# Altium schematic sheet DRV8302.SchDoc
size 431 x 279 mm; SheetNumber: 4; SheetTotal: 6
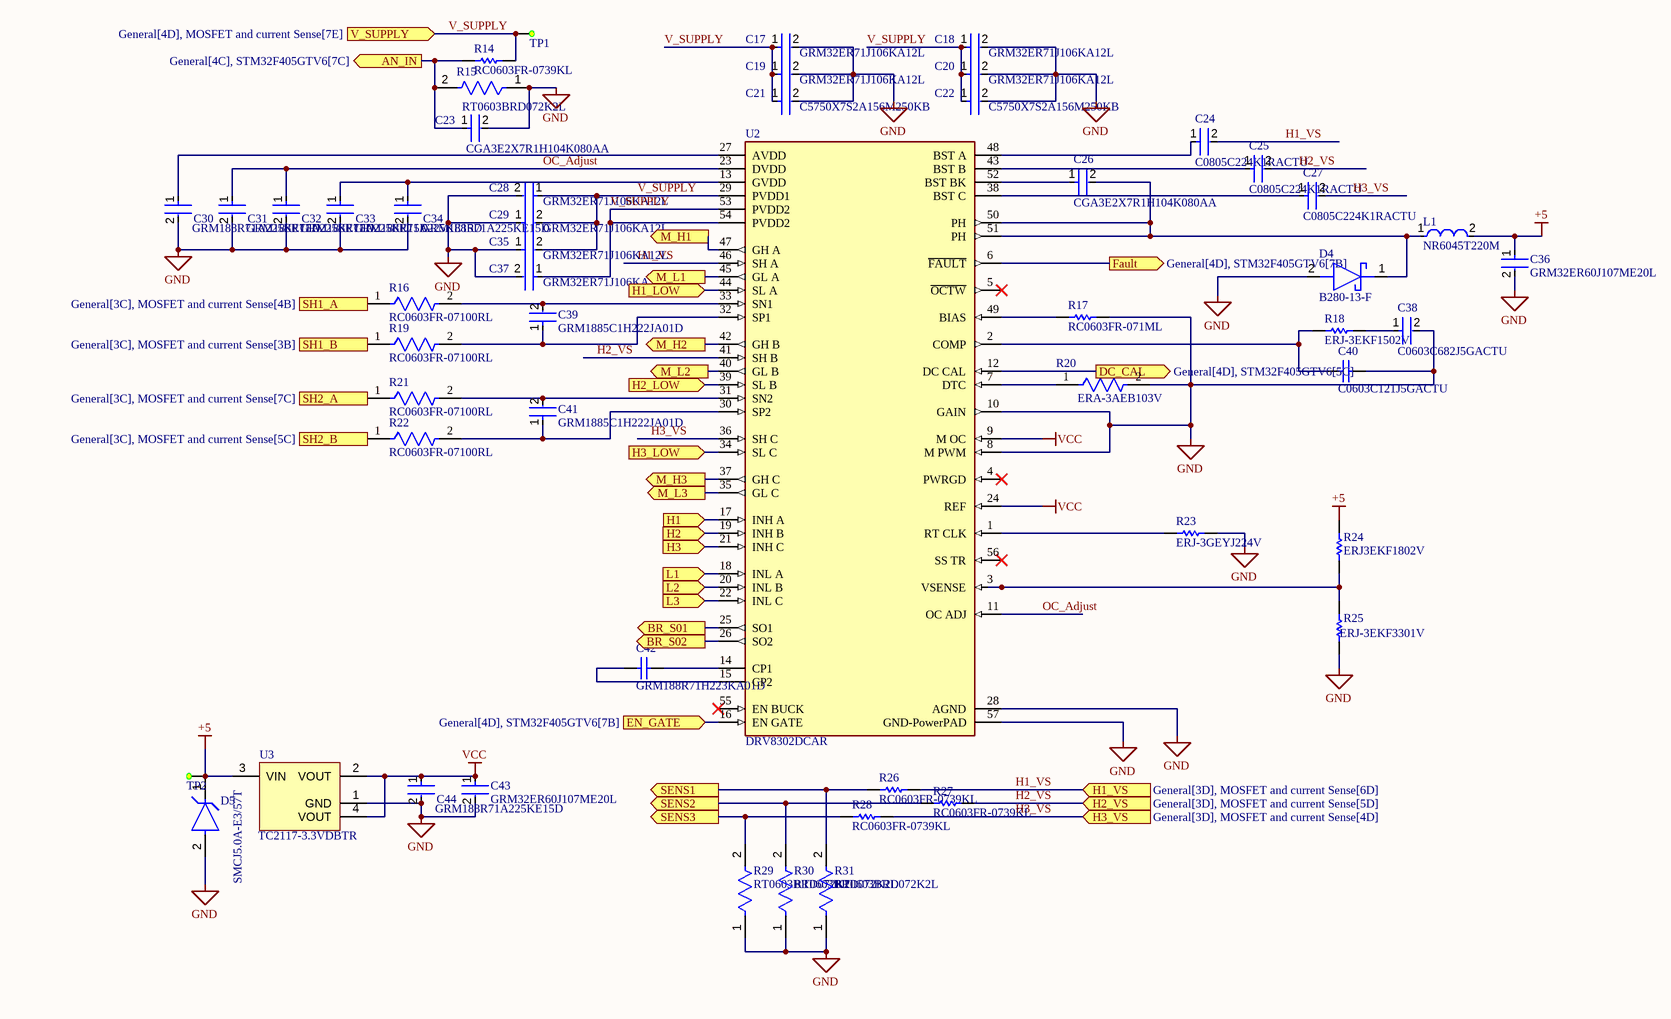
[diagram p0: DRV8302.SchDoc]

## Parts
C17  GRM32ER71J106KA12L  [FP-GRM32E-0_2-0_3-MFG]
C18  GRM32ER71J106KA12L  [FP-GRM32E-0_2-0_3-MFG]
C19  GRM32ER71J106KA12L  [FP-GRM32E-0_2-0_3-MFG]
C20  GRM32ER71J106KA12L  [FP-GRM32E-0_2-0_3-MFG]
C21  C5750X7S2A156M250KB  [FP-C5750-250-0_4-IPC_B]
C22  C5750X7S2A156M250KB  [FP-C5750-250-0_4-IPC_B]
C23  CGA3E2X7R1H104K080AA  [FP-CGA3E-0_3-0_1-IPC_A]
C24  C0805C224K1RACTU  [FP-C0805C-DN-MFG]
C25  C0805C224K1RACTU  [FP-C0805C-DN-MFG]
C26  CGA3E2X7R1H104K080AA  [FP-CGA3E-0_3-0_1-IPC_A]
C27  C0805C224K1RACTU  [FP-C0805C-DN-MFG]
C28  GRM32ER71J106KA12L  [FP-GRM32E-0_2-0_3-MFG]
C29  GRM32ER71J106KA12L  [FP-GRM32E-0_2-0_3-MFG]
C30  GRM188R71A225KE15D  [FP-GRM188-0_1-e0_2_0_5-MFG]
C31  GRM188R71A225KE15D  [FP-GRM188-0_1-e0_2_0_5-MFG]
C32  GRM188R71A225KE15D  [FP-GRM188-0_1-e0_2_0_5-MFG]
C33  GRM188R71A225KE15D  [FP-GRM188-0_1-e0_2_0_5-MFG]
C34  GRM188R71A225KE15D  [FP-GRM188-0_1-e0_2_0_5-MFG]
C35  GRM32ER71J106KA12L  [FP-GRM32E-0_2-0_3-MFG]
C36  GRM32ER60J107ME20L  [FP-GRM32-0_3-MFG]
C37  GRM32ER71J106KA12L  [FP-GRM32E-0_2-0_3-MFG]
C38  C0603C682J5GACTU  [FP-C0603C-CF-MFG]
C39  GRM1885C1H222JA01D  [FP-GRM188-0_1-e0_2_0_5-MFG]
C40  C0603C121J5GACTU  [CAPC1608X87X35LL15T15]
C41  GRM1885C1H222JA01D  [FP-GRM188-0_1-e0_2_0_5-MFG]
C42  GRM188R71H223KA01D  [CAPC1608X90X35ML10T15]
C43  GRM32ER60J107ME20L  [FP-GRM32-0_3-MFG]
C44  GRM188R71A225KE15D  [FP-GRM188-0_1-e0_2_0_5-MFG]
D4  B280-13-F  [DIOM5336X250N]
D5  SMCJ5.0A-E3/57T  [FP-95402-MFG]
L1  NR6045T220M  [FP-NR6045-MFG]
R14  RC0603FR-0739KL  [RESC1608X55X25LL10T15]
R15  RT0603BRD072K2L  [FP-RT0603-MFG]
R16  RC0603FR-07100RL  [FP-RC0603-0_55-MFG]
R17  RC0603FR-071ML  [RESC1608X55X25LL10T15]
R18  ERJ-3EKF1502V  [RESC1608X55X30NL15T15]
R19  RC0603FR-07100RL  [FP-RC0603-0_55-MFG]
R20  ERA-3AEB103V  [FP-ERA3A-IPC_C]
R21  RC0603FR-07100RL  [FP-RC0603-0_55-MFG]
R22  RC0603FR-07100RL  [FP-RC0603-0_55-MFG]
R23  ERJ-3GEYJ224V  [RESC1608X55X30LL15T15]
R24  ERJ3EKF1802V  [RESC1608X55X30LL15T15]
R25  ERJ-3EKF3301V  [RESC1609X55X30ML15T15]
R26  RC0603FR-0739KL  [RESC1608X55X25LL10T15]
R27  RC0603FR-0739KL  [RESC1608X55X25LL10T15]
R28  RC0603FR-0739KL  [RESC1608X55X25LL10T15]
R29  RT0603BRD072K2L  [FP-RT0603-MFG]
R30  RT0603BRD072K2L  [FP-RT0603-MFG]
R31  RT0603BRD072K2L  [FP-RT0603-MFG]
TP1  Test point  [Test point]  (value not drawn)
TP2  Test point  [Test point]  (value not drawn)
U2  DRV8302DCAR  [FP-DCA0056A-IPC_C]
U3  TC2117-3.3VDBTR  [SOT-223-DB3_N]

## Ports
AN_IN (out, see General[4C], STM32F405GTV6[7C]), BR_S01 (out, see General[4C], STM32F405GTV6[5D]), BR_S02 (out, see General[4C], STM32F405GTV6[5D]), DC_CAL (out, see General[4D], STM32F405GTV6[5C]), EN_GATE (in, see General[4D], STM32F405GTV6[7B]), Fault (out, see General[4D], STM32F405GTV6[7B]), H1 (in, see General[4D], STM32F405GTV6[7C]), H1_LOW (in, see General[3D], MOSFET and current Sense[6C]), H1_VS (in, see General[3D], MOSFET and current Sense[6D]), H2 (in, see General[4D], STM32F405GTV6[7C]), H2_LOW (in, see General[3D], MOSFET and current Sense[5C]), H2_VS (in, see General[3D], MOSFET and current Sense[5D]), H3 (in, see General[4D], STM32F405GTV6[7C]), H3_LOW (in, see General[3D], MOSFET and current Sense[3C]), H3_VS (in, see General[3D], MOSFET and current Sense[4D]), L1 (in, see General[4D], STM32F405GTV6[5C]), L2 (in, see General[4D], STM32F405GTV6[5C]), L3 (in, see General[4D], STM32F405GTV6[5C]), M_H1 (out, see General[3D], MOSFET and current Sense[7E]), M_H2 (out, see General[3D], MOSFET and current Sense[6E]), M_H3 (out, see General[3D], MOSFET and current Sense[4E]), M_L1 (out, see General[3D], MOSFET and current Sense[7D]), M_L2 (out, see General[3D], MOSFET and current Sense[5D]), M_L3 (out, see General[3D], MOSFET and current Sense[4D]), SENS1 (out, see General[4C], STM32F405GTV6[7D]), SENS2 (out, see General[4C], STM32F405GTV6[7D]), SENS3 (out, see General[4C], STM32F405GTV6[7D]), SH1_A (in, see General[3C], MOSFET and current Sense[4B]), SH1_B (in, see General[3C], MOSFET and current Sense[3B]), SH2_A (in, see General[3C], MOSFET and current Sense[7C]), SH2_B (in, see General[3C], MOSFET and current Sense[5C]), V_SUPPLY (in, see General[4D], MOSFET and current Sense[7E])

## Nets
+5: C36.1 D5.1(C) L1.2 R24.2 TP2.TP?(Test_point) U3.3(VIN)
GND: C17.2 C18.2 C19.2 C20.2 C21.2 C22.2 C23.2 C28.2 C29.1 C30.2 C31.2 C32.2 C33.2 C34.2 C35.1 C36.2 C37.2 C38.2 C40.2 C43.2 C44.2 D4.2(A) D5.2(A) R15.1 R17.2 R20.2 R23.2 R25.1 R29.1 R30.1 R31.1 U2.8(M_PWM) U2.10(GAIN) U2.28(AGND) U2.57(GND-PowerPAD) U3.1(GND)
VCC: C43.1 C44.1 U2.9(M_OC) U2.24(REF) U3.2(VOUT) U3.4(VOUT)
AN_IN: C23.1 R14.1 R15.2 ; port AN_IN
BR_S01: U2.25(SO1) ; port BR_S01
BR_S02: U2.26(SO2) ; port BR_S02
DC_CAL: U2.12(DC_CAL) ; port DC_CAL
EN_GATE: U2.16(EN_GATE) ; port EN_GATE
Fault: U2.6(~{FAULT}) ; port Fault
H1: U2.17(INH_A) ; port H1
H1_LOW: U2.44(SL_A) ; port H1_LOW
H1_VS: C24.2 R26.2 U2.46(SH_A) ; port H1_VS
H2: U2.19(INH_B) ; port H2
H2_LOW: U2.39(SL_B) ; port H2_LOW
H2_VS: C25.2 R27.2 U2.41(SH_B) ; port H2_VS
H3: U2.21(INH_C) ; port H3
H3_LOW: U2.34(SL_C) ; port H3_LOW
H3_VS: C27.2 R28.2 U2.36(SH_C) ; port H3_VS
L1: U2.18(INL_A) ; port L1
L2: U2.20(INL_B) ; port L2
L3: U2.22(INL_C) ; port L3
M_H1: U2.47(GH_A) ; port M_H1
M_H2: U2.42(GH_B) ; port M_H2
M_H3: U2.37(GH_C) ; port M_H3
M_L1: U2.45(GL_A) ; port M_L1
M_L2: U2.40(GL_B) ; port M_L2
M_L3: U2.35(GL_C) ; port M_L3
OC_Adjust: C31.1 C32.1 U2.11(OC_ADJ) U2.23(DVDD)
SENS1: R26.1 R31.2 ; port SENS1
SENS2: R27.1 R30.2 ; port SENS2
SENS3: R28.1 R29.2 ; port SENS3
SH1_A: R16.1 ; port SH1_A
SH1_B: R19.1 ; port SH1_B
SH2_A: R21.1 ; port SH2_A
SH2_B: R22.1 ; port SH2_B
V_SUPPLY: C17.1 C18.1 C19.1 C20.1 C21.1 C22.1 C28.1 C29.2 C35.2 C37.1 R14.2 TP1.TP?(Test_point) U2.29(PVDD1) U2.53(PVDD2) U2.54(PVDD2) ; port V_SUPPLY
NetC24_1: C24.1 U2.48(BST_A)
NetC25_1: C25.1 U2.43(BST_B)
NetC26_1: C26.1 U2.52(BST_BK)
NetC26_2: C26.2 D4.1(K) L1.1 U2.50(PH) U2.51(PH)
NetC27_1: C27.1 U2.38(BST_C)
NetC30_1: C30.1 U2.27(AVDD)
NetC33_1: C33.1 C34.1 U2.13(GVDD)
NetC38_1: C38.1 R18.2
NetC39_1: C39.1 R19.2 U2.32(SP1)
NetC39_2: C39.2 R16.2 U2.33(SN1)
NetC40_1: C40.1 R18.1 U2.2(COMP)
NetC41_1: C41.1 R22.2 U2.30(SP2)
NetC41_2: C41.2 R21.2 U2.31(SN2)
NetC42_1: C42.1 U2.15(CP2)
NetC42_2: C42.2 U2.14(CP1)
NetR17_1: R17.1 U2.49(BIAS)
NetR20_1: R20.1 U2.7(DTC)
NetR23_1: R23.1 U2.1(RT_CLK)
NetR24_1: R24.1 R25.2 U2.3(VSENSE)

Not connected (* = marked no-connect by the designer): U2 4(PWRGD)* 5(~{OCTW})* 55(EN_BUCK)* 56(SS_TR)*

## Notes on the sheet
- DWG. NO.
- REV.
- SHT.
- THIS DOCUMENT AND THE DATA DISCLOSED HEREIN OR HEREWITH IS THE PROPERTY OF ALTIUM LIMITED AND MAY BE FREELY DISTRIBUTED IN WHOLE. NO RIGHTS ARE RESERVED OR EXPRESS OR IMPLIED WARANTEE GIVEN.
- REVISION
- DESCRIPTION
- DATE
- APPROVED
- ENG:
- APPROVALS
- PROJECT
- DSN:
- CHK:
- REFERENCE DOCUMENTS
- PROJECT REVISION:
- TITLE
- DOCUMENT REVISION:
- DESIGN ITEM:
- BOM:
- FAB DWG:
- PCB DWG:
- ASSY DWG:
- SCALE:
- SIZE
- B
- CAGE CODE
- FILE NAME
- DWG NO.
- SHEET
- OF
- REV

## Library data of the parts
C17-C20 C28 C29 C35 C37 = CMP-2000-07458-2: CAP CER 10UF 63V X7R 1210; Material: Ceramic; Tolerance: 10%; Package Quantity: 1000; Weight: 0.00388oz; Voltage Rating (DC): 63V; Packaging: Tape and Reel; Length: 3.2mm; Width: 2.5mm; REACH SVHC: No SVHC; Max Operating Temperature: 125°C; Dielectric Material: Ceramic; Thickness: 0.106inch; Mount: Surface Mount; Case Code (Metric): 3225; Depth: 2.5mm; Voltage Rating: 63V; RoHS Compliant: Yes; Capacitance: 10uF; Lead Free: Lead Free; Dielectric: X7R; Case Code (Imperial): 1210; Min Operating Temperature: -55°C; Height: 2.5mm; Case/Package: 1210; Voltage: 63V; Termination: SMD/SMT
C21 C22 = CMP-2000-05460-2: Multilayer Ceramic Capacitors 15uF ±20% 100V X7S SMD 2220; Min Operating Temperature: -55°C; Weight: 0.016932oz; Length: 0.224inch; Depth: 5mm; Series: C; Mount: Surface Mount; RoHS Compliant: Yes; REACH SVHC: No SVHC; Width: 0.197inch; Case Code (Imperial): 2220; Capacitance: 15uF; Termination: SMD/SMT; Dielectric: X7S; Case Code (Metric): 5750; Tolerance: 20%; Lead Free: Lead Free; Resistor Type: Ceramic; Case/Package: 2220; Voltage Rating (DC): 100V; Packaging: Tape and Reel; Thickness: 0.11inch; Height: 2.5mm; Voltage Rating: 100V; Max Operating Temperature: 125°C; Package Quantity: 1
C23 C26 = CMP-2000-07546-2: Cap Ceramic 100nF 50V X7R 10% Pad SMD 0603 +125°C Automotive T/R; Weight: 7.1E-05oz; Composition: Ceramic; Max Operating Temperature: 125°C; Termination: SMD/SMT; Dielectric: X7R; Length: 1.6mm; Package Quantity: 1; REACH SVHC: No SVHC; Lead Free: Lead Free; Case Code (Metric): 1608; Min Operating Temperature: -55°C; Packaging: Tape and Reel; Tolerance: 10%; Voltage Rating: 50V; Case Code (Imperial): 0603; Capacitance: 100nF; Case/Package: 0603; Voltage Rating (DC): 50V; Depth: 0.8mm; Radiation Hardening: No; Ratings: AEC-Q200; Mount: Surface Mount; Voltage: 50V; Thickness: 0.035inch; Width: 0.8mm; Height: 0.8mm
C24 C25 C27 = CMP-2007-03262-2: CAP CER 0.22UF 100V 10% X7R 0805; Manufacturer: KEMET; Material: Ceramic; Tolerance: 0.1; Value: 0.22 μF; Temperature Coefficient: 30ppm/°C; Temperature Range High: +125°C; Temperature Range Low: -55°C; Voltage Rating: 100 V; Device Class L2: Capacitors; Manufacturer Part Number: C0805C224K1RACTU; Octopart: https://octopart.com/c0805c224k1ractu-kemet-12818106; ComponentLink2URL: https://content.kemet.com/datasheets/KEM_C1003_C0G_SMD.pdf; RoHS: TRUE; Temperature: -55°C to +125°C; Ipc Land Pattern Name: CAPC200125X78; Category: Cap; ComponentLink2Description: Datasheet; Height: 0.88mm; Device Class L1: Passive Components; Digikey Description: CAP CER 0.22UF 100V 10% X7R 0805; Mouser Description: 0805 C 220nF Ceramic Multilayer Capacitor, 100 V, +125degC, X7R Dielec, +/-10%; Capacitance: 0.22 μF; Package: C0805C-DN; Lead Free: Yes; Automotive: No; Temperature Characteristic: X7R; Device Class L3: Ceramic Capacitors
C30-C34 C44 = CMP-2006-02836-2: Chip Multilayer Ceramic Capacitors for General Purpose, 0603, 2.2uF, X7R, 15%, 10%, 10V; Case Code (Metric): 1608; Height: 0.8mm; Packaging: Cut Tape; Voltage: 10V; Lead Free: Lead Free; Min Operating Temperature: -55°C; Voltage Rating (DC): 10V; Max Operating Temperature: 125°C; Voltage Rating: 10V; Dielectric: X7R; Depth: 0.8mm; Case Code (Imperial): 0603; Termination: SMD/SMT; Case/Package: 0603; Number of Pins: 2; REACH SVHC: No SVHC; Mount: Surface Mount; Width: 0.031inch; Material: Ceramic; Capacitance: 2.2uF; Package Quantity: 1; Weight: 7.1E-05oz; Length: 1.6mm; Thickness: 0.035inch; Tolerance: 10%
C36 C43 = CMP-2000-05259-2: CAP CER 100UF 6.3V X5R 1210; 3DS Part Number: 220-00002; Manufacturer: Murata; Temperature Coefficient: 15%; Material: Ceramic; Tolerance: 20%; Octopart: https://octopart.com/grm32er60j107me20l-murata-197007; ComponentLink2URL: https://search.murata.co.jp/Ceramy/image/img/A01X/G101/ENG/GRM32ER60J107ME20-01.pdf; Temperature Range High: +85°C; RoHS: TRUE; Device Class L3: Ceramic Capacitors; Manufacturer Part Number: GRM32ER60J107ME20L; Device Class L2: Capacitors; Voltage: 6.3V; Package: GRM32-0.3; Voltage Rating: 6.3V; Category: Cap; Device Class L1: Passive Components; Temperature Characteristic: X5R; Automotive: No; Digikey Description: CAP CER 100UF 6.3V X5R 1210; Temperature: -55°C to +85°C; Height: 2.7mm; Ipc Land Pattern Name: CAPC320250X250; Capacitance: 100uF; Temperature Range Low: -55°C; Lead Free: Yes; Value: 100uF; ComponentLink2Description: Datasheet
C38 = CMP-2006-03259-2: CAP CER 6800PF 50V 5% NP0 0603; Manufacturer: KEMET; Temperature Characteristic: C0G; Automotive Grade: Grade 1; Material: Ceramic; Capacitance: 6,800 pF; Tolerance: 0.05; Temperature Coefficient: 30ppm/°C; Value: 6,800 pF; Temperature Range Low: -55°C; RoHS: TRUE; Lead Free: Yes; Device Class L1: Passive Components; Temperature: -55°C to +125°C; Device Class L2: Capacitors; Device Class L3: Ceramic Capacitors; Octopart: https://octopart.com/c0603c682j5gactu-kemet-12793182; Package: C0603C-CF; Voltage Rating: 50 V; ComponentLink2URL: https://api.kemet.com/component-edge/download/datasheet/C0603C100J5GACAUTO.pdf; ComponentLink2Description: Datasheet; Category: Cap; Automotive: Yes; Temperature Range High: +125°C; Mouser Description: Multilayer Ceramic Capacitors MLCC - SMD/SMT 50volts 6800pF 5% C0G; Height: 0.87mm; Digikey Description: CAP CER 6800PF 50V 5% NP0 0603; Manufacturer Part Number: C0603C682J5GACTU
C39 C41 = CMP-06035-056041-1: Chip Multilayer Ceramic Capacitors for General Purpose, 0603, 2200pF, C0G, 30ppm/°C, 5%, 50V; Insulation Resistance: 10GR; Capacitance: 2.2nF; Min Operating Temperature: -55°C; Voltage: 50V; Tolerance: 5%; Height: 0.8mm; Packaging: Tape and Reel; Length: 1.6mm; Mount: Surface Mount; Temperature Coefficient: 30ppm/°C; Case Code (Metric): 1608; Case/Package: 0603; Lead Free: Lead Free; Voltage Rating: 50V; Termination: SMD/SMT; Max Operating Temperature: 125°C; Voltage Rating (DC): 50V; Number of Pins: 2; Dielectric: C0G; Material: Ceramic; Thickness: 0.035inch; REACH SVHC: No SVHC; Dielectric Material: Ceramic; Case Code (Imperial): 0603; Radiation Hardening: No; Package Quantity: 1; Width: 0.8mm; Depth: 0.8mm
C40 = CMP-2006-03074-1: Manufacturer: Kemet; Part Number: C0603C121J5GACTU
C42 = CMP-2006-02910-1: Manufacturer: Murata; Part Number: GRM188R71H223KA01D
D4 = B280-13-F: Schottky Diode; Manufacturer_Name: Diodes Incorporated; Datasheet Link: https://www.diodes.com/assets/Datasheets/ds30021.pdf; Height: 2.5mm; Manufacturer_Part_Number: B280-13-F; Mouser Part Number: 621-B280-13-F; Mouser Price/Stock: https://www.mouser.com/Search/Refine.aspx?Keyword=621-B280-13-F; Arrow Part Number: B280-13-F; Arrow Price/Stock: https://www.arrow.com/en/products/b280-13-f/diodes-incorporated
D5 = CMP-02577-000008-1: TVS DIODE 5V 9.2V DO214AB; Manufacturer: Vishay Semiconductor Diodes Division; Number Of Channels: 1; Breakdown Voltage: 6.4V; Standoff Height: 0mm; Peak Pulse Current: 163A; Peak Pulse Power: 1500W; Max Junction Temp: +150°C; Direction: Unidirectional; Digikey Description: TVS DIODE 5V 9.2V DO214AB; Mouser Description: TVS Diodes - Transient Voltage Suppressors 1500W 5.0V Unidirect; Manufacturer Part Number: SMCJ5.0A-E3/57T; Device Class L2: TVS Diodes; Height: 2.62mm; Temperature Range High: +150°C; Reverse Standoff Voltage: 5V; Package: 95402; Category: Diode; Temperature: -55°C to +150°C; Lead Free: Yes; ComponentLink2Description: Datasheet; Device Class L3: unset; Device Class L1: Circuit Protection; Automotive: No; Clamping Voltage: 9.2V; Octopart: https://octopart.com/smcj5.0a-e3%2F57t-vishay-39559239; ComponentLink2URL: https://www.vishay.com/docs/88394/smcj.pdf; Footprint Url: https://www.vishay.com/docs/95402/smc.pdf; Temperature Range Low: -55°C; RoHS: TRUE
L1 = CMP-14484-000872-1: Shielded Wirewound Inductor 22uH 20% 1.5A 0.1495Ω SMD; DC Resistance (DCR): 149.5mR; Self Resonant Frequency: 7MHz; Core Material: Ferrite; Saturation Current: 1.9A; Test Frequency: 100kHz; Mount: Surface Mount; RMS Current (Irms): 1.5A; Packaging: Tape and Reel; RoHS Compliant: Yes; Termination: SMD/SMT; Resistor Type: Wirewound; Inductance: 22uH; Inductance Tolerance: 20%; Number of Pins: 2; Series: NR; Height: 4.5mm; Package Quantity: 1500; Shielding: Shielded; Max Operating Temperature: 120°C; Length: 0.236inch; Halogen Free: Halogen Free; Width: 0.236inch; Min Operating Temperature: -25°C; Current Rating: 1.5A; Height - Seated (Max): 0.177inch; Case/Package: Nonstandard; Max DC Current: 1.5A; Tolerance: 20%
R14 R26-R28 = CMP-2000-06940-1: Chip Resistor, 39 KOhm, +/- 1%, 0.1 W, -55 to 155 degC, 0603 (1608 Metric), RoHS, Tape and Reel; Manufacturer: Yageo; Resistance: 39kOhms; Voltage Rating: 50V; Power Rating: 100mW; Temperature Coefficient: 100PPM/C; Product: ThickFilmResistorsGeneralPurpose; Case Code - in: 0603; Tolerance: 1%; Operating Temperature Range: -55Cto+155C; Series: RC; Package Description: 2-Pin Surface Mount Device, Body 1.6 x 0.8 mm; Datasheet URL: http://www.yageo.com/documents/recent/PYu-RC_Group_51_RoHS_L_7.pdf; Package Reference: 0603; Case Code - mm: 1608; Datasheet Version: Rev. 7, 05/2017; Mounting Technology: SurfaceMount; Packaging: Reel; Manufacturer URL: http://www.yageo.com/; Termination Style: SMD/SMT
R15 R29-R31 = CMP-2000-04423-2: RES 2.20K OHM 1/10W .1% SMD 0603; Manufacturer: Yageo; Power Rating: 0.1W; Tolerance: 0.001; Value: 2.2KΩ; Voltage Rating: 75V; Temperature Coefficient: 25 ppm/°C; Series: RT; Manufacturer Part Number: RT0603BRD072K2L; ComponentLink2URL: http://www.yageo.com/documents/recent/PYu-RT_1-to-0.01_RoHS_L_9.pdf; Octopart: https://octopart.com/rt0603brd072k2l-yageo-1186019; Digikey Description: RES 2.20K OHM 1/10W .1% SMD 0603; Device Class L1: Passive Components; Temperature: -55°C to +155°C; ComponentLink2Description: Datasheet; Mouser Description: High Precision-High Stability Chip Resistor Thin Film 0603 2.2kOhm 0.1% Paper T/R; RoHS: TRUE; Footprint Url: http://www.yageo.com/exep/pages/download/literatures/PYu-R_Mount_10.pdf; Height: 0.55mm; Device Class L2: Resistors; Temperature Range Low: -55°C; Ipc Land Pattern Name: RESC16080X45; Composition: Thin Film; Lead Free: Yes; Temperature Range High: +155°C; Category: Res; Automotive: No; Resistance: 2.2KΩ; Package: RT0603; Device Class L3: Chip SMD Resistors
R16 R19 R21 R22 = CMP-2100-03663-2: NexarPartId: 55402879; Voltage Rating: 50V; Power Rating: 100mW; Tolerance: 1%; Temperature Coefficient: 100ppm/°C; Resistance: 100Ω; Case/Package: 0603; Military Standard: Not; REACH SVHC: Unknown; Case Code (Metric): 0603; Max Operating Temperature: 155°C; Schedule B: 8533210045, 8533210045; Height: 450µm; Length: 1.6mm; Lead Free: Lead Free; Packaging: Tape & Reel; Case Code (Imperial): 0603; Composition: Thick Film; Min Operating Temperature: -55°C; Voltage Rating (DC): 50V; RoHS: Compliant; Depth: 800µm; Number of Pins: 2; Termination: SMD/SMT; Width: 800µm
R17 = CMP-1659-00056-1: Chip Resistor, 1 MOhm, +/- 1%, 100 mW, -55 to 155 degC, 0603 (1608 Metric), RoHS, Tape and Reel; Voltage Rating (DC): 25 V; Tolerance: 20%; Case\Package: Radial; Capacitance: 1 mF; Min Operating Temperature: -40 degC; PackageDescription: 2-Pin Surface Mount Device, Body 1.6 x 0.8 mm; ComponentLink1Description: Manufacturer URL; Radiation Hardening: No; DatasheetVersion: Rev. 4, 02/2016; REACH SVHC: No SVHC; Length: 20 mm; Max Operating Temperature: 85 degC; Diameter: 10 mm; Packaging: Bulk; Package Quantity: 200; PackageReference: 0603; Mount: Through Hole; ComponentLink1URL: http://www.yageo.com/; ComponentLink2URL: http://www.yageo.com/documents/recent/PYu-RC_Group_51_RoHS_L_04.pdf; ComponentLink2Description: Datasheet; Width: 0 inch; Lead Pitch: 5 mm; RoHSCompliant: true; Voltage Rating: 25 V; Height: 20 mm
R18 = CMP-2000-00258-1: Manufacturer: Panasonic; Part Number: ERJ-3EKF1502V
R20 = CMP-2000-00874-2: RES SMD 10K OHM 0.1% 1/10W 0603; Voltage Rating (DC): 75V; Power Rating: 100mW; Resistance: 10kR; Temperature Coefficient: 25ppm/°C; Radiation Hardening: No; Width: 0.8mm; Depth: 0.8mm; Construction: Rectangular; Case Code (Metric): 1608; Package Quantity: 5000; Length: 1.6mm; Size Code: 0603; Case Code (Imperial): 0603; Termination: SMD/SMT; Contact Plating: Tin; Resistance Tolerance: 0.1%; Military Standard: Not; Packaging: Tape and Reel; Max Power Dissipation: 100mW; REACH SVHC: No SVHC; Series: ERA-3A; Voltage Rating: 75V; Lead Free: Lead Free; Technology: METAL FILM; RoHS Compliant: Yes; Max Operating Temperature: 155°C; Resistor Type: Thin Film; Min Operating Temperature: -55°C; Number of Pins: 2; Case/Package: 0603; Tolerance: 0.1%; Height: 0.45mm; Mount: Surface Mount; Number of Terminations: 2
R23 = CMP-2000-00749-1: Manufacturer: Panasonic; Part Number: ERJ-3GEYJ224V
R24 = CMP-1012-00650-3: Fixed Resistor, Metal Glaze/thick Film, 0.1W, 18000ohm, 75V, 1% +/-Tol, 100ppm/Cel, Surface Mount, 0603; Manufacturer: Panasonic; Part Number: ERJ3EKF1802V
R25 = CMP-2000-00436-2: Chip Resistors, 3.3 KOhm, +/- 1%, 0.1 W, 0603 (1608 Metric), -55 to 155 degC, RoHS, Tape and Reel; Manufacturer: Panasonic; Max Power Dissipation: 100mW; Voltage Rating: 75V; Temperature Coefficient: 100ppm/degreesC; Datasheet Version: 42095.0; Width: 0.8mm; Mount: SurfaceMount; Radiation Hardening: No; Package URL: http://www.st.com/st-web-ui/static/active/en/resource/technical/document/datasheet/CD00001320.pdf; Depth: 0.8mm; Package Description: 2-Pin Surface Mount Device, Body 1.6 x 0.85 mm; Package Quantity: 1; Contact Plating: Tin; Length: 1.6mm; Max Operating Temperature: 155degC; RoHSCompliant: true; Datasheet URL: https://industrial.panasonic.com/cdbs/www-data/pdf/RDA0000/AOA0000C283.pdf; Height: 0.022inch; Military Standard: Not; Termination: SMD/SMT; Case Code (Metric): 1608; Composition: ThickFilm; Resistance: 3.3KOhm; Packaging: TapeandReel; Min Operating Temperature: -55degC; Case/Package: 0603; Voltage Rating (DC): 75V; Lead Free: LeadFree; Package Reference: 0603; Power Rating: 100mW; Manufacturer URL: http://www.panasonic.com/; Case Code (Imperial): 0603; REACH SVHC: NoSVHC; Number of Terminations: 2; Number of Pins: 2; Tolerance: 1%
U2 = CMP-04915-000065-1: IC MOTOR DRIVER 8V-60V 56HTSSOP; Number of Outputs: 2; Min Supply Voltage: 8V; Nominal Supply Current: 15mA; Max Supply Voltage: 60V; Interface: Parallel; Output Current: 1.7A; Max Operating Temperature: 125°C; Min Operating Temperature: -40°C; Packaging: Tape and Reel; Number of Pins: 56; Radiation Hardening: No; Supply Current: 15mA; REACH SVHC: No SVHC; Case/Package: HTSSOP; Series: DRV8302; RoHS Compliant: Yes; Lead Free: Lead Free; Mount: Surface Mount; Package Quantity: 2000
U3 = CMP-0136-00509-1: 800 mA Fixed Low Dropout Positive Regulator, 3-Pin SOT-223, Extended Temperature, Tape and Reel; PackageVersion: revBB, Aug-2009; DatasheetVersion: revC, Oct-2006; PackageReference: SOT-223-DB3; PackageDescription: 3-Lead Plastic Small Outline Transistor (DB) [SOT-223]
TP1 TP2 = Test point: value: Test point